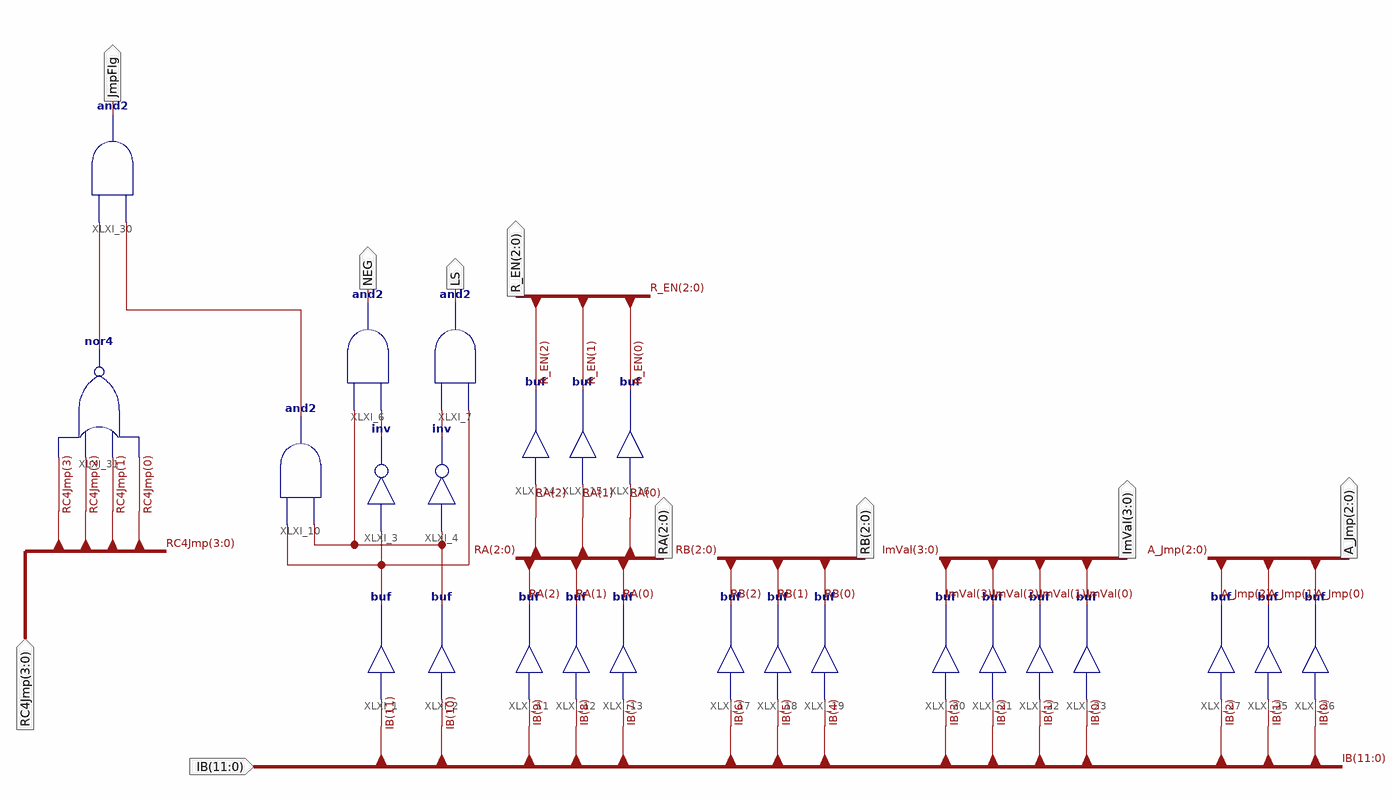
[diagram p0: schematic sheet 1]
// Xilinx ISE schematic ID.sch (spartan3e) as structural Verilog: 25 symbols, 10 ports
module ID (
  input  [11:0] IB,
  input  [3:0] RC4Jmp,
  output NEG,
  output LS,
  output [2:0] RA,
  output [2:0] R_EN,
  output [2:0] RB,
  output [3:0] ImVal,
  output [2:0] A_Jmp,
  output JmpFlg
);

  wire XLXN_5, XLXN_6, XLXN_14, XLXN_17, XLXN_91, XLXN_92;

  buf XLXI_1 (XLXN_5, IB[11]);
  buf XLXI_2 (XLXN_6, IB[10]);
  not XLXI_3 (XLXN_14, XLXN_5);
  not XLXI_4 (XLXN_17, XLXN_6);
  and XLXI_6 (NEG, XLXN_14, XLXN_6);
  and XLXI_7 (LS, XLXN_5, XLXN_17);
  and XLXI_10 (XLXN_92, XLXN_6, XLXN_5);
  buf XLXI_11 (RA[2], IB[9]);
  buf XLXI_12 (RA[1], IB[8]);
  buf XLXI_13 (RA[0], IB[7]);
  buf XLXI_14 (R_EN[2], RA[2]);
  buf XLXI_15 (R_EN[1], RA[1]);
  buf XLXI_16 (R_EN[0], RA[0]);
  buf XLXI_17 (RB[2], IB[6]);
  buf XLXI_18 (RB[1], IB[5]);
  buf XLXI_19 (RB[0], IB[4]);
  buf XLXI_20 (ImVal[3], IB[3]);
  buf XLXI_21 (ImVal[2], IB[2]);
  buf XLXI_22 (ImVal[1], IB[1]);
  buf XLXI_23 (ImVal[0], IB[0]);
  buf XLXI_25 (A_Jmp[1], IB[1]);
  buf XLXI_26 (A_Jmp[0], IB[0]);
  buf XLXI_27 (A_Jmp[2], IB[2]);
  and XLXI_30 (JmpFlg, XLXN_92, XLXN_91);
  nor XLXI_31 (XLXN_91, RC4Jmp[0], RC4Jmp[1], RC4Jmp[2], RC4Jmp[3]);
endmodule
